# EAGLE schematic rel-cu (EAGLE 9.6.2)
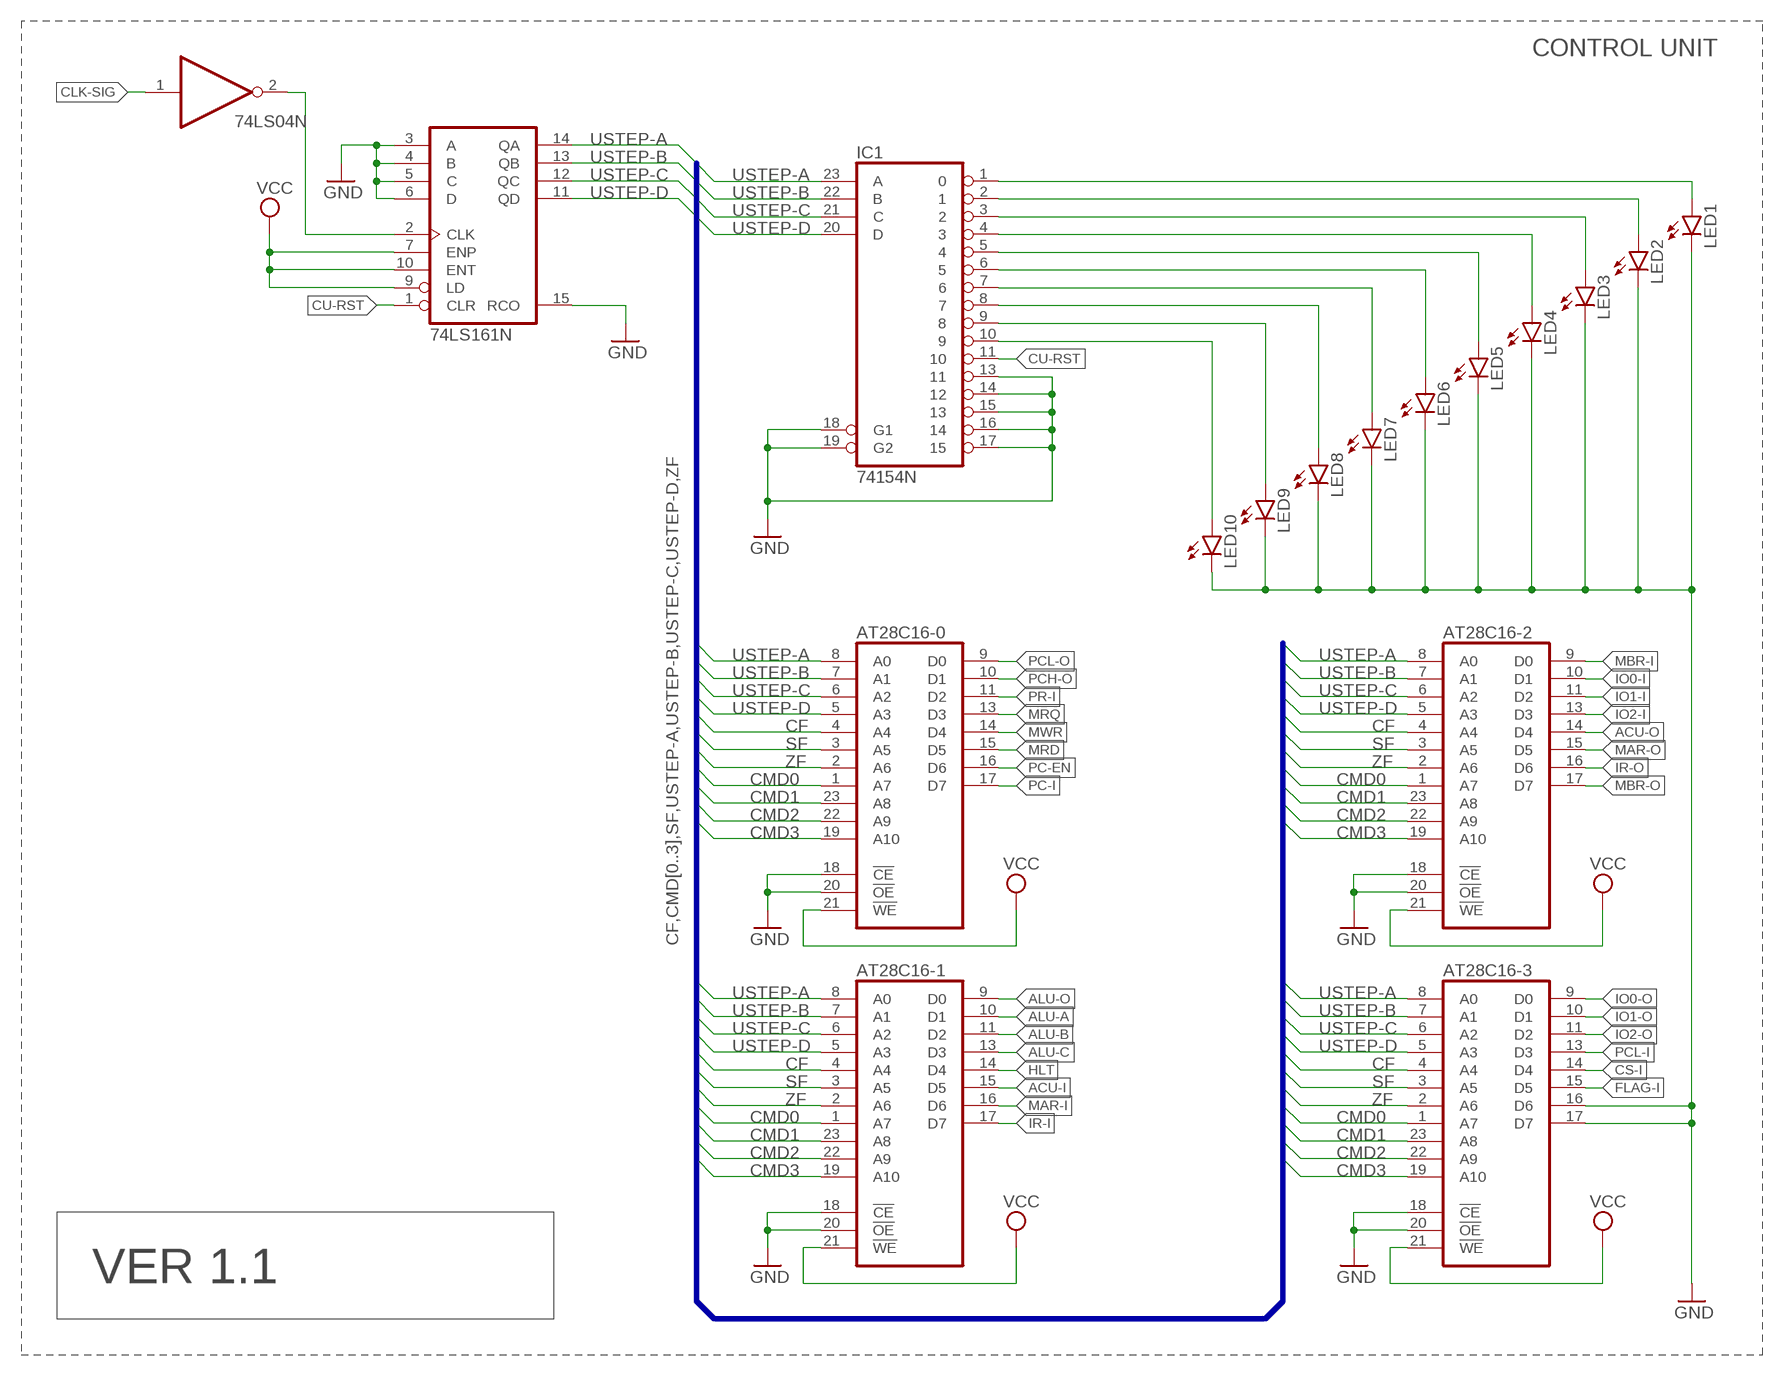
[diagram p0: schematic, sheet 1]

## Parts
74LS161N  74160N  [DIL16]
AT28C16-0  2816  [DIL24]
AT28C16-1  2816  [DIL24]
AT28C16-2  2816  [DIL24]
AT28C16-3  2816  [DIL24]
IC1  74154N  [DIL24-6]
IC2  74LS04N  [DIL14]
LED1  LED5MM  [LED5MM]
LED2  LED5MM  [LED5MM]
LED3  LED5MM  [LED5MM]
LED4  LED5MM  [LED5MM]
LED5  LED5MM  [LED5MM]
LED6  LED5MM  [LED5MM]
LED7  LED5MM  [LED5MM]
LED8  LED5MM  [LED5MM]
LED9  LED5MM  [LED5MM]
LED10  LED5MM  [LED5MM]

## Nets
ACU-I: AT28C16-1.15(D5)
ACU-O: AT28C16-2.14(D4)
ALU-A: AT28C16-1.10(D1)
ALU-B: AT28C16-1.11(D2)
ALU-C: AT28C16-1.13(D3)
ALU-O: AT28C16-1.9(D0)
CF: AT28C16-0.4(A4) AT28C16-1.4(A4) AT28C16-2.4(A4) AT28C16-3.4(A4)
CLK-SIG: 74LS161N.2(CLK) IC2.1(A:I) IC2.2(A:O)
CMD0: AT28C16-0.1(A7) AT28C16-1.1(A7) AT28C16-2.1(A7) AT28C16-3.1(A7)
CMD1: AT28C16-0.23(A8) AT28C16-1.23(A8) AT28C16-2.23(A8) AT28C16-3.23(A8)
CMD2: AT28C16-0.22(A9) AT28C16-1.22(A9) AT28C16-2.22(A9) AT28C16-3.22(A9)
CMD3: AT28C16-0.19(A10) AT28C16-1.19(A10) AT28C16-2.19(A10) AT28C16-3.19(A10)
CS-I: AT28C16-3.14(D4)
CU-RST: 74LS161N.1(CLR) IC1.11
FLAG-I: AT28C16-3.15(D5)
GND: 74LS161N.3(A) 74LS161N.4(B) 74LS161N.5(C) 74LS161N.6(D) 74LS161N.15(RCO) AT28C16-0.18(!CE) AT28C16-0.20(!OE) AT28C16-1.18(!CE) AT28C16-1.20(!OE) AT28C16-2.18(!CE) AT28C16-2.20(!OE) AT28C16-3.16(D6) AT28C16-3.17(D7) AT28C16-3.18(!CE) AT28C16-3.20(!OE) IC1.13 IC1.14 IC1.15 IC1.16 IC1.17 IC1.18(G1) IC1.19(G2) LED1.K(C) LED2.K(C) LED3.K(C) LED4.K(C) LED5.K(C) LED6.K(C) LED7.K(C) LED8.K(C) LED9.K(C) LED10.K(C)
HLT: AT28C16-1.14(D4)
IO0-I: AT28C16-2.10(D1)
IO0-O: AT28C16-3.9(D0)
IO1-I: AT28C16-2.11(D2)
IO1-O: AT28C16-3.10(D1)
IO2-I: AT28C16-2.13(D3)
IO2-O: AT28C16-3.11(D2)
IR-I: AT28C16-1.17(D7)
IR-O: AT28C16-2.16(D6)
MAR-I: AT28C16-1.16(D6)
MAR-O: AT28C16-2.15(D5)
MBR-I: AT28C16-2.9(D0)
MBR-O: AT28C16-2.17(D7)
MRD: AT28C16-0.15(D5)
MRQ: AT28C16-0.13(D3)
MWR: AT28C16-0.14(D4)
N$1: IC1.1 LED1.A
N$2: IC1.2 LED2.A
N$3: IC1.3 LED3.A
N$4: IC1.4 LED4.A
N$5: IC1.5 LED5.A
N$6: IC1.6 LED6.A
N$7: IC1.7 LED7.A
N$8: IC1.8 LED8.A
N$9: IC1.9 LED9.A
N$10: IC1.10 LED10.A
PC-EN: AT28C16-0.16(D6)
PC-I: AT28C16-0.17(D7)
PCH-O: AT28C16-0.10(D1)
PCL-I: AT28C16-3.13(D3)
PCL-O: AT28C16-0.9(D0)
PR-I: AT28C16-0.11(D2)
SF: AT28C16-0.3(A5) AT28C16-1.3(A5) AT28C16-2.3(A5) AT28C16-3.3(A5)
USTEP-A: 74LS161N.14(QA) AT28C16-0.8(A0) AT28C16-1.8(A0) AT28C16-2.8(A0) AT28C16-3.8(A0) IC1.23(A)
USTEP-B: 74LS161N.13(QB) AT28C16-0.7(A1) AT28C16-1.7(A1) AT28C16-2.7(A1) AT28C16-3.7(A1) IC1.22(B)
USTEP-C: 74LS161N.12(QC) AT28C16-0.6(A2) AT28C16-1.6(A2) AT28C16-2.6(A2) AT28C16-3.6(A2) IC1.21(C)
USTEP-D: 74LS161N.11(QD) AT28C16-0.5(A3) AT28C16-1.5(A3) AT28C16-2.5(A3) AT28C16-3.5(A3) IC1.20(D)
VCC: 74LS161N.7(ENP) 74LS161N.9(LD) 74LS161N.10(ENT) AT28C16-0.21(!WE) AT28C16-1.21(!WE) AT28C16-2.21(!WE) AT28C16-3.21(!WE)
ZF: AT28C16-0.2(A6) AT28C16-1.2(A6) AT28C16-2.2(A6) AT28C16-3.2(A6)
Unconnected: IC2.3(B:I) IC2.4(B:O) IC2.5(C:I) IC2.6(C:O) IC2.8(D:O) IC2.9(D:I) IC2.10(E:O) IC2.11(E:I) IC2.12(F:O) IC2.13(F:I)

## Buses
CF,CMD[0..3],SF,USTEP-A,USTEP-B,USTEP-C,USTEP-D,ZF

## Notes on the sheet
- CONTROL UNIT
- VER 1.1

## Power pins joined to a net without a drawn wire
GND: 74LS161N.8(GND) AT28C16-0.12(GND) AT28C16-1.12(GND) AT28C16-2.12(GND) AT28C16-3.12(GND) IC1.12(GND) IC2.7(P:GND)
VCC: 74LS161N.16(VCC) AT28C16-0.24(VCC) AT28C16-1.24(VCC) AT28C16-2.24(VCC) AT28C16-3.24(VCC) IC1.24(VCC) IC2.14(P:VCC)

## Library data of the parts
74LS161N = 74xx-eu:74*160: Synchronous 4-bit COUNTER
AT28C16-0 AT28C16-1-AT28C16-3 = memory:2816: MEMORY
IC1 = 74xx-eu:74*154: 4-line to 16-line data SELECTOR/MULTIPLEXER
IC2 = 74xx-eu:74*04: Hex INVERTER
LED1-LED10 = led:LED: LED OSRAM: - CHIPLED LG R971, LG N971, LY N971, LG Q971, LY Q971, LO R971, LY R971 LH N974, LH R974 LS Q976, LO Q976, LY Q976 LO Q996 - Hyper CHIPLED LW Q18S LB Q993, LB Q99A, LB R99A - SideLED LS A670, LO A670, LY A670, LG A670, LP A670 LB A673, LV A673, LT A673, LW A673 LH A674 LY A675 LS A676, LA A676, LO A676, LY A676, LW A676 LS A679, LY A679, LG A679 - Hyper Micro SIDELED® LS Y876, LA Y876, LO Y876, LY Y876 LT Y87S - SmartLED LW L88C, LW L88S LB L89C, LB L89S, LG L890 LS L89K, LO L89K, LY L89K LS L896, LA L896, LO L896, LY L896 - TOPLED LS T670, LO T670, LY T670, LG T670, LP T670 LSG T670, LSP T670, LSY T670, LOP T670, LYG T670 LG T671, LOG T671, LSG T671 LB T673, LV T673, LT T673, LW T673 LH T674 LS T676, LA T676, LO T676, LY T676, LB T676, LH T676, LSB T676, LW T676 LB T67C, LV T67C, LT T67C, LS T67K, LO T67K, LY T67K, LW E67C LS E67B, LA E67B, LO E67B, LY E67B, LB E67C, LV E67C, LT E67C LW T67C LS T679, LY T679, LG T679 LS T770, LO T770, LY T770, LG T770, LP T770 LB T773, LV T773, LT T773, LW T773 LH T774 LS E675, LA E675, LY E675, LS T675 LS T776, LA T776, LO T776, LY T776, LB T776 LHGB T686 LT T68C, LB T68C - Hyper Mini TOPLED® LB M676 - Mini TOPLED Santana® LG M470 LS M47K, LO M47K, LY M47K Source: http://www.osram.convergy.de LUXEON: - LUMILED® LXK2-PW12-R00, LXK2-PW12-S00, LXK2-PW14-U00, LXK2-PW14-V00 LXK2-PM12-R00, LXK2-PM12-S00, LXK2-PM14-U00 LXK2-PE12-Q00, LXK2-PE12-R00, LXK2-PE12-S00, LXK2-PE14-T00, LXK2-PE14-U00 LXK2-PB12-K00, LXK2-PB12-L00, LXK2-PB12-M00, LXK2-PB14-N00, LXK2-PB14-P00, LXK2-PB14-Q00 LXK2-PR12-L00, LXK2-PR12-M00, LXK2-PR14-Q00, LXK2-PR14-R00 LXK2-PD12-Q00, LXK2-PD12-R00, LXK2-PD12-S00 LXK2-PH12-R00, LXK2-PH12-S00 LXK2-PL12-P00, LXK2-PL12-Q00, LXK2-PL12-R00 Source: www.luxeon.com KINGBRIGHT: KA-3528ASYC Source: www.kingbright.com